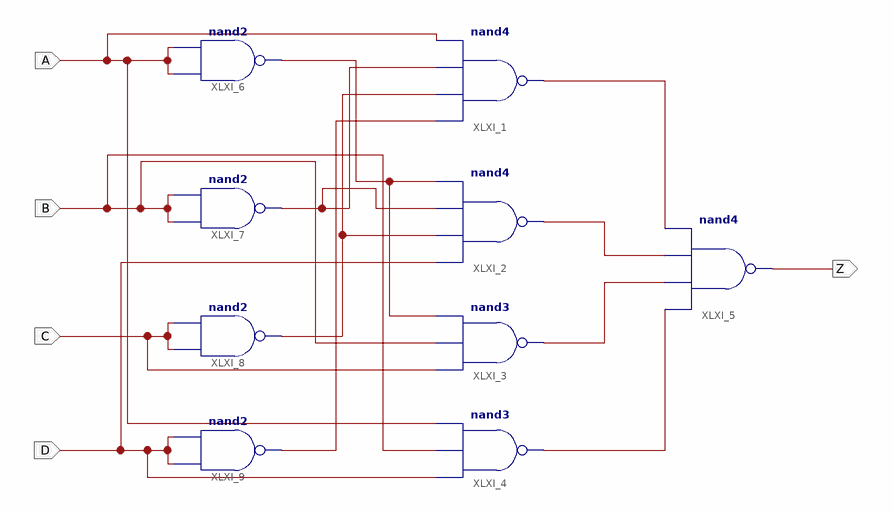
[diagram p0: schematic sheet 1]
// Xilinx ISE schematic p1ej1b.sch (xbr) as structural Verilog: 9 symbols, 5 ports
module p1ej1b (
  input  B,
  input  A,
  input  C,
  input  D,
  output Z
);

  wire XLXN_1, XLXN_2, XLXN_3, XLXN_4, XLXN_17, XLXN_18, XLXN_19, XLXN_20;

  nand XLXI_1 (XLXN_1, XLXN_20, XLXN_19, XLXN_18, A);
  nand XLXI_2 (XLXN_2, D, XLXN_19, XLXN_18, XLXN_17);
  nand XLXI_3 (XLXN_3, C, B, XLXN_17);
  nand XLXI_4 (XLXN_4, D, B, A);
  nand XLXI_5 (Z, XLXN_4, XLXN_3, XLXN_2, XLXN_1);
  nand XLXI_6 (XLXN_17, A, A);
  nand XLXI_7 (XLXN_18, B, B);
  nand XLXI_8 (XLXN_19, C, C);
  nand XLXI_9 (XLXN_20, D, D);
endmodule
